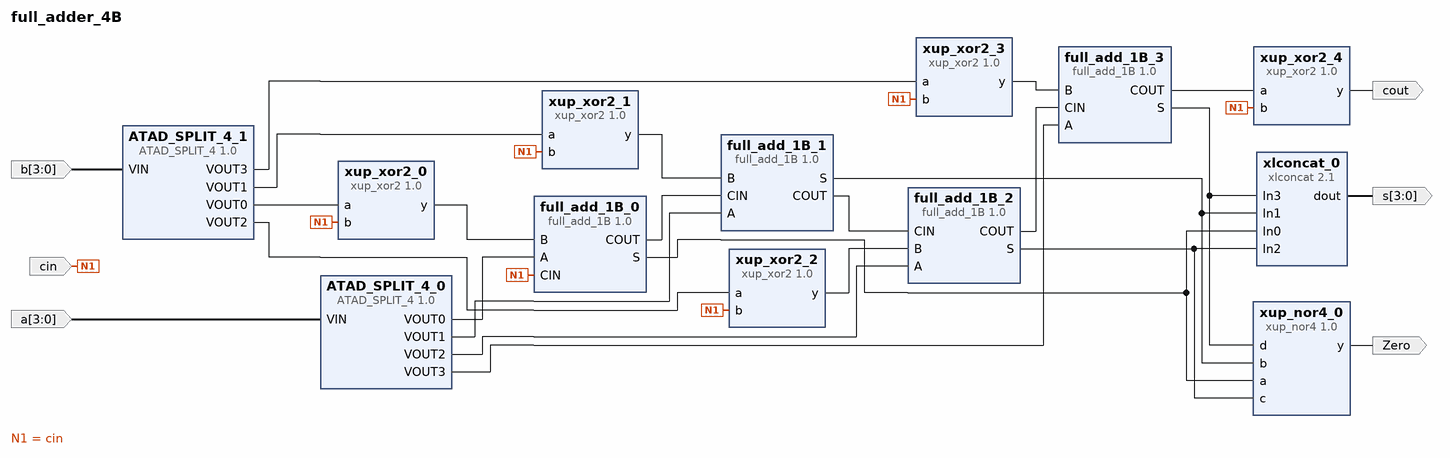
[diagram p0: block diagram of the top level]
# Vivado block design full_adder_4B, xc7a100tcsg324-1, Vivado 2019.1
create_bd_design full_adder_4B

create_bd_port -dir I -from 3 -to 0 a
create_bd_port -dir I -from 3 -to 0 b
create_bd_port -dir I cin
create_bd_port -dir O cout
create_bd_port -dir O Zero
create_bd_port -dir O -from 3 -to 0 s

create_bd_cell -type ip -vlnv xilinx.com:user:full_add_1B:1.0 full_add_1B_0
create_bd_cell -type ip -vlnv xilinx.com:user:full_add_1B:1.0 full_add_1B_1
create_bd_cell -type ip -vlnv xilinx.com:user:full_add_1B:1.0 full_add_1B_2
create_bd_cell -type ip -vlnv xilinx.com:user:full_add_1B:1.0 full_add_1B_3
create_bd_cell -type ip -vlnv xilinx.com:xup:xup_nor4:1.0 xup_nor4_0
create_bd_cell -type ip -vlnv xilinx.com:xup:xup_xor2:1.0 xup_xor2_0
create_bd_cell -type ip -vlnv xilinx.com:xup:xup_xor2:1.0 xup_xor2_1
create_bd_cell -type ip -vlnv xilinx.com:xup:xup_xor2:1.0 xup_xor2_2
create_bd_cell -type ip -vlnv xilinx.com:xup:xup_xor2:1.0 xup_xor2_3
create_bd_cell -type ip -vlnv xilinx.com:user:ATAD_SPLIT_4:1.0 ATAD_SPLIT_4_0
create_bd_cell -type ip -vlnv xilinx.com:user:ATAD_SPLIT_4:1.0 ATAD_SPLIT_4_1
create_bd_cell -type ip -vlnv xilinx.com:ip:xlconcat:2.1 xlconcat_0
set_property -dict {CONFIG.NUM_PORTS 4} [get_bd_cells xlconcat_0]
create_bd_cell -type ip -vlnv xilinx.com:xup:xup_xor2:1.0 xup_xor2_4

# ---- connections ----

connect_bd_net [get_bd_pins full_add_1B_0/COUT] [get_bd_pins full_add_1B_1/CIN]
connect_bd_net [get_bd_pins full_add_1B_1/COUT] [get_bd_pins full_add_1B_2/CIN]
connect_bd_net [get_bd_pins full_add_1B_2/COUT] [get_bd_pins full_add_1B_3/CIN]
connect_bd_net [get_bd_ports a] [get_bd_pins ATAD_SPLIT_4_0/VIN]
connect_bd_net [get_bd_ports b] [get_bd_pins ATAD_SPLIT_4_1/VIN]
connect_bd_net [get_bd_pins ATAD_SPLIT_4_1/VOUT0] [get_bd_pins xup_xor2_0/a]
connect_bd_net [get_bd_pins ATAD_SPLIT_4_1/VOUT1] [get_bd_pins xup_xor2_1/a]
connect_bd_net [get_bd_pins ATAD_SPLIT_4_1/VOUT2] [get_bd_pins xup_xor2_2/a]
connect_bd_net [get_bd_pins ATAD_SPLIT_4_1/VOUT3] [get_bd_pins xup_xor2_3/a]
connect_bd_net [get_bd_ports cin] \
  [get_bd_pins xup_xor2_0/b] [get_bd_pins xup_xor2_3/b] [get_bd_pins xup_xor2_2/b] [get_bd_pins xup_xor2_1/b] \
  [get_bd_pins xup_xor2_4/b] [get_bd_pins full_add_1B_0/CIN]
connect_bd_net [get_bd_pins xup_xor2_0/y] [get_bd_pins full_add_1B_0/B]
connect_bd_net [get_bd_pins xup_xor2_1/y] [get_bd_pins full_add_1B_1/B]
connect_bd_net [get_bd_pins xup_xor2_2/y] [get_bd_pins full_add_1B_2/B]
connect_bd_net [get_bd_pins xup_xor2_3/y] [get_bd_pins full_add_1B_3/B]
connect_bd_net [get_bd_pins ATAD_SPLIT_4_0/VOUT0] [get_bd_pins full_add_1B_0/A]
connect_bd_net [get_bd_pins ATAD_SPLIT_4_0/VOUT1] [get_bd_pins full_add_1B_1/A]
connect_bd_net [get_bd_pins ATAD_SPLIT_4_0/VOUT2] [get_bd_pins full_add_1B_2/A]
connect_bd_net [get_bd_pins ATAD_SPLIT_4_0/VOUT3] [get_bd_pins full_add_1B_3/A]
connect_bd_net [get_bd_pins full_add_1B_3/COUT] [get_bd_pins xup_xor2_4/a]
connect_bd_net [get_bd_pins xlconcat_0/dout] [get_bd_ports s]
connect_bd_net [get_bd_pins full_add_1B_0/S] [get_bd_pins xup_nor4_0/a] [get_bd_pins xlconcat_0/In0]
connect_bd_net [get_bd_pins full_add_1B_1/S] [get_bd_pins xup_nor4_0/b] [get_bd_pins xlconcat_0/In1]
connect_bd_net [get_bd_pins full_add_1B_2/S] [get_bd_pins xup_nor4_0/c] [get_bd_pins xlconcat_0/In2]
connect_bd_net [get_bd_pins full_add_1B_3/S] [get_bd_pins xup_nor4_0/d] [get_bd_pins xlconcat_0/In3]
connect_bd_net [get_bd_pins xup_nor4_0/y] [get_bd_ports Zero]
connect_bd_net [get_bd_pins xup_xor2_4/y] [get_bd_ports cout]

validate_bd_design
save_bd_design
